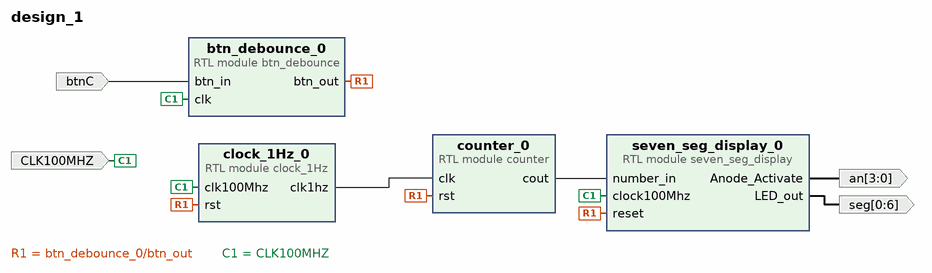
[diagram p0: block diagram of the top level]
# Vivado block design design_1, xc7a35tcpg236-1, Vivado 2018.2.2
create_bd_design design_1

create_bd_port -dir O -from 3 -to 0 an
create_bd_port -dir I -type clk CLK100MHZ
set_property -dict {CONFIG.FREQ_HZ 100000000} [get_bd_ports CLK100MHZ]
create_bd_port -dir I btnC
create_bd_port -dir O -from 0 -to 6 seg

create_bd_cell -type module -reference btn_debounce btn_debounce_0
create_bd_cell -type module -reference seven_seg_display seven_seg_display_0
create_bd_cell -type module -reference counter counter_0
create_bd_cell -type module -reference clock_1Hz clock_1Hz_0

# ---- connections ----

connect_bd_net [get_bd_pins btn_debounce_0/btn_out] [get_bd_pins seven_seg_display_0/reset] [get_bd_pins counter_0/rst] [get_bd_pins clock_1Hz_0/rst]
connect_bd_net [get_bd_pins seven_seg_display_0/Anode_Activate] [get_bd_ports an]
connect_bd_net [get_bd_ports btnC] [get_bd_pins btn_debounce_0/btn_in]
connect_bd_net [get_bd_pins seven_seg_display_0/LED_out] [get_bd_ports seg]
connect_bd_net [get_bd_pins counter_0/cout] [get_bd_pins seven_seg_display_0/number_in]
connect_bd_net [get_bd_pins clock_1Hz_0/clk1hz] [get_bd_pins counter_0/clk]
connect_bd_net [get_bd_ports CLK100MHZ] \
  [get_bd_pins seven_seg_display_0/clock100Mhz] [get_bd_pins btn_debounce_0/clk] [get_bd_pins clock_1Hz_0/clk100Mhz]

validate_bd_design
save_bd_design
